# EAGLE design t6713 (EAGLE 8.5.0)
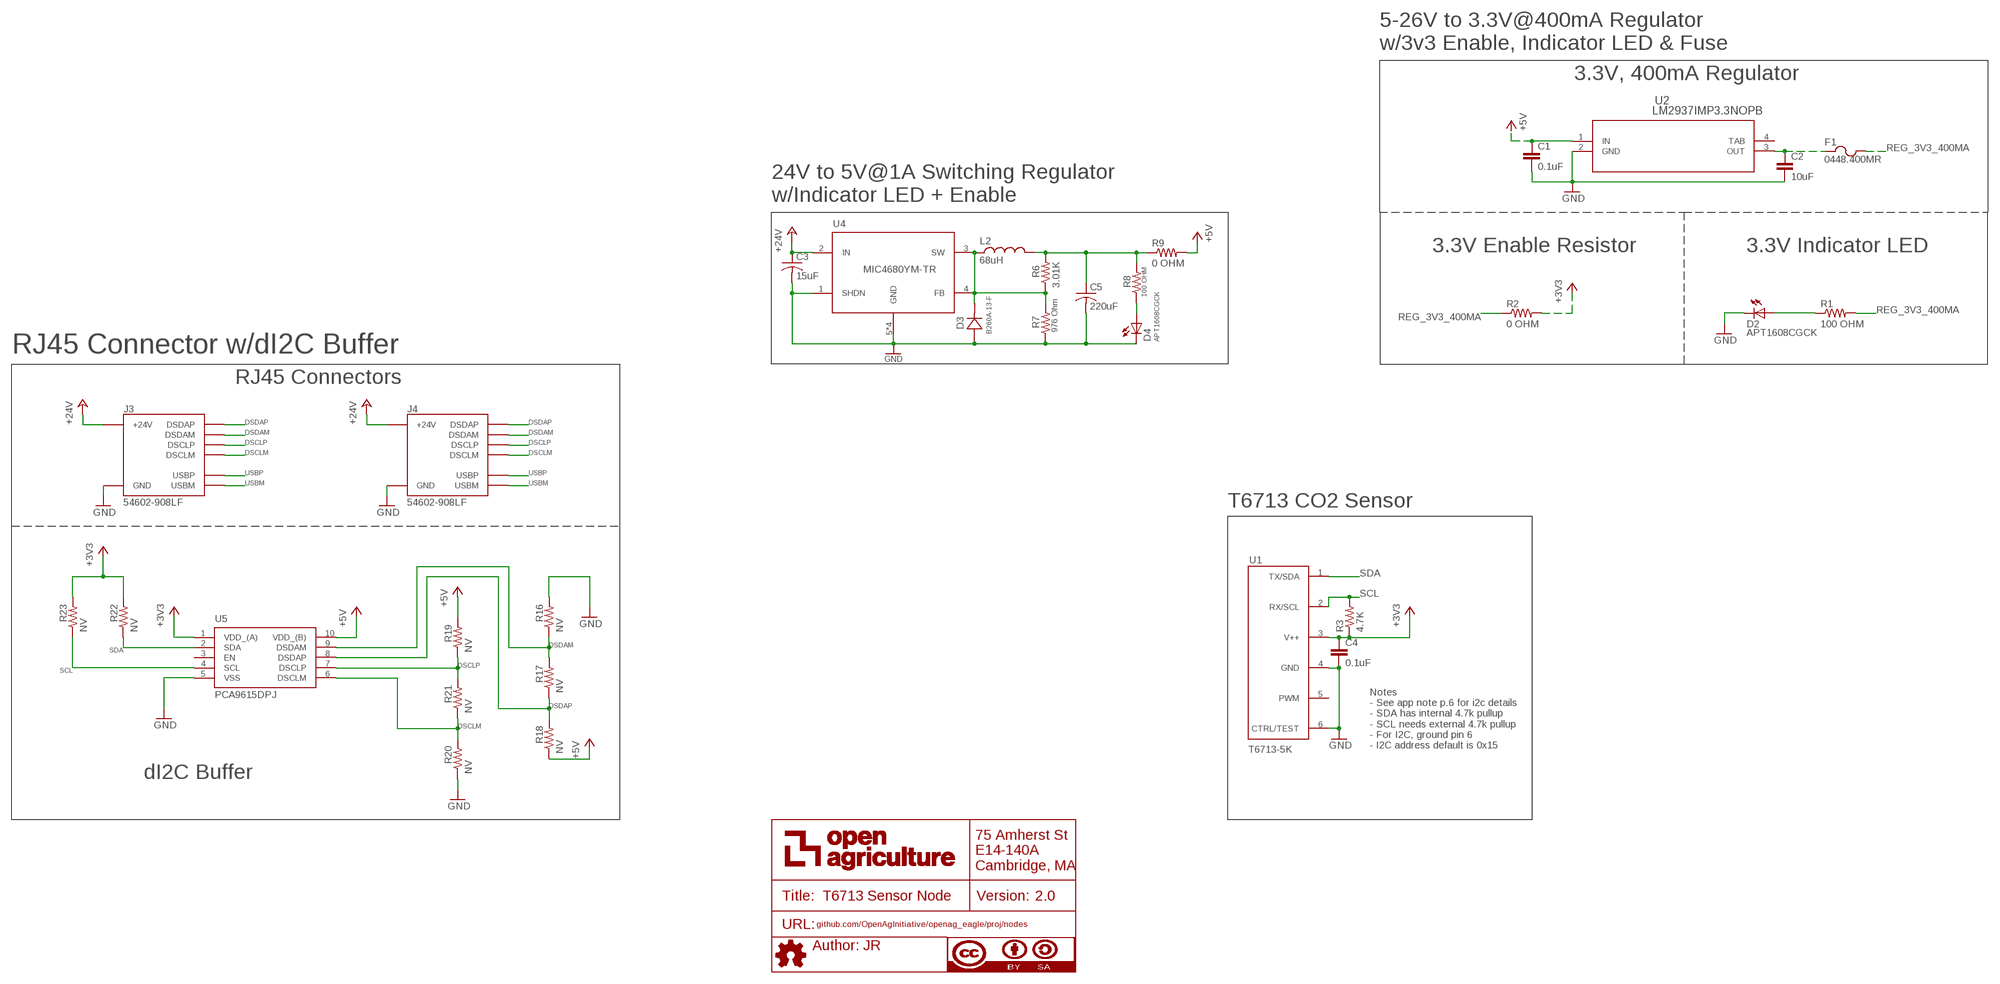
[diagram p0: schematic, sheet 1]

## Parts
C1  0.1uF  0.1UF-C0603C104K5RACTU  [C0603]
C2  10uF  10UF-GMK212BBJ106KG-T  [C0805]
C3  15uF  15UF-TPSD156K035R0100  [CT7343]
C4  0.1uF  0.1UF-C0603C104K5RACTU  [C0603]
C5  220uF  220UF-TPSY227K010R0100  [CT7343]
D2  APT1608CGCK  [CHIPLED_0603]
D3  B260A-13-F  [SMA]
D4  APT1608CGCK  [CHIPLED_0603]
F1  0448.400MR  0438.375WR  [0603]
FRAME1  DOCFIELD  [DOCFIELD]
J3  54602-908LF  OPENAG-V1-RJ45PTH  [OPENAG-V1-RJ45]
J4  54602-908LF  OPENAG-V1-RJ45PTH  [OPENAG-V1-RJ45]
L2  68uH  68UH-UP2B-680-R  [UP2B]
R1  100 OHM  100OHM-RC0603JR-07100RL  [RC0603N]
R2  0 OHM  0OHM-RC0603JR-070RL  [RC0603N]
R3  4.7K  4.7K-RC1206JR-074K7L  [R1206]
R6  3.01K  3.01K-RC0603FR-073K01L  [RC0603N]
R7  976 Ohm  982OHM-RC0603FR-07976RL  [RC0603N]
R8  100 OHM  100OHM-RC0603JR-07100RL  [RC0603N]
R9  0 OHM  0OHM-RC0603JR-070RL  [RC0603N]
R16  NV  R0603  [RC0603N]
R17  NV  R0603  [RC0603N]
R18  NV  R0603  [RC0603N]
R19  NV  R0603  [RC0603N]
R20  NV  R0603  [RC0603N]
R21  NV  R0603  [RC0603N]
R22  NV  R0603  [RC0603N]
R23  NV  R0603  [RC0603N]
U1  T6713-5K  [T6713]
U2  LM2937IMP3.3NOPB  LM2937IMP-3.3/NOPB  [MP04A]
U4  MIC4680YM-TR  [SOIC8]
U5  PCA9615DPJ  [SOP50P490X110-10N]

## Nets
+3V3: C4.1 R2.2 R3.1 R22.2 R23.2 U1.3(V++) U5.1(VDD_(A))
+5V: C1.1 R9.2 R18.1 R19.2 U2.1(IN) U5.10(VDD_(B))
+24V: C3.+(1(+)) J3.24V(6)(+24V) J4.24V(6)(+24V) U4.2(IN)
DSCLM: J3.DSCLM(5)(DSCLM) J4.DSCLM(5)(DSCLM) R20.2 R21.1 U5.6(DSCLM)
DSCLP: J3.DSCLP(4)(DSCLP) J4.DSCLP(4)(DSCLP) R19.1 R21.2 U5.7(DSCLP)
DSDAM: J3.DSDAM(2)(DSDAM) J4.DSDAM(2)(DSDAM) R16.1 R17.2 U5.9(DSDAM)
DSDAP: J3.DSDAP(1)(DSDAP) J4.DSDAP(1)(DSDAP) R17.1 R18.2 U5.8(DSDAP)
GND: C1.2 C2.2 C3.-(2(-)) C4.2 C5.-(2(-)) D2.C D3.2 D4.C J3.GND(3)(GND) J4.GND(3)(GND) R7.1 R16.2 R20.1 U1.4(GND) U1.6(CTRL/TEST) U2.2(GND) U4.1(SHDN) U4.5(GND) U4.6(GND) U4.7(GND) U4.8(GND) U5.5(VSS)
N$4: D3.1 L2.1 R6.1 R7.2 U4.3(SW) U4.4(FB)
N$6: D2.A R1.1
N$7: C2.1 F1.1 U2.3(OUT)
N$8: D4.A R8.1
N$9: C5.+(1(+)) L2.2 R6.2 R8.2 R9.1
REG_3V3_400MA: F1.2 R1.2 R2.1
SCL: R3.2 R23.1 U1.2(RX/SCL) U5.4(SCL)
SDA: R22.1 U1.1(TX/SDA) U5.2(SDA)
USBM: J3.USBM(8)(USBM) J4.USBM(8)(USBM)
USBP: J3.USBP(7)(USBP) J4.USBP(7)(USBP)
Unconnected: U1.5(PWM) U5.3(EN)

## Notes on the sheet
- 5-26V to 3.3V@400mA Regulator 
  w/3v3 Enable, Indicator LED & Fuse
- 3.3V, 400mA Regulator
- 24V to 5V@1A Switching Regulator
  w/Indicator LED + Enable
- 3.3V Enable Resistor | 3.3V Indicator LED
- RJ45 Connector w/dI2C Buffer
- RJ45 Connectors
- T6713 CO2 Sensor
- Notes
  - See app note p.6 for i2c details
  - SDA has internal 4.7k pullup
  - SCL needs external 4.7k pullup
  - For I2C, ground pin 6
  - I2C address default is 0x15
- dI2C Buffer

## Power pins joined to a net without a drawn wire
TAB: U2.4(TAB)

## Library data of the parts
C1 C4 = openag-capacitors:0.1UF-C0603C104K5RACTU: Kemet - C0603C104K5RACTU - CAP CER 0.1UF 50V X7R 0603 Description: 0.1µF ±10% 50V Ceramic Capacitor X7R 0603 (1608 Metric) Technical Specifications: Capacitance: 0.1µF Tolerance: ±10% Rated Voltage: 50V Temperature Coefficient: X7R Operating Temperature: -55°C ~ 125°C Package / Case: 0603 (1608 Metric) Datasheet(s): X7R Dielectric, 6.3-250 VDC <https://search.kemet.com/component-edge/download/datasheet/C0603C104K5RACTU.pdf> Vendor(s): Digikey: 399-5089-1-ND <https://www.digikey.com/product-detail/en/kemet/C0603C104K5RACTU/399-5089-1-ND/1465623>; POPULATE: YES; VERIFIED: NO
C2 = openag-capacitors:10UF-GMK212BBJ106KG-T: Taiyo Yuden - GMK212BBJ106KG-T - CAP CER 10UF 35V X5R 0805 Description: 10µF ±10% 35V Ceramic Capacitor X5R 0805 (2012 Metric) Technical Specifications: Capacitance: 10µF Tolerance: ±10% Rated Voltage: 35V Temperature Coefficient: X5R Operating Temperature: -55°C ~ 85°C Package / Case: 0805 (2012 Metric) Datasheet(s): GMK212BBJ106KG-T Spec <http://ds.yuden.co.jp/TYCOMPAS/ut/detail.do?productNo=GMK212BBJ106KG-T&fileName=GMK212BBJ106KG-T_SS&mode=specSheetDownload> Vendor(s): Digikey: 587-4893-1-ND <https://www.digikey.com/product-detail/en/taiyo-yuden/GMK212BBJ106KG-T/587-4893-1-ND/6563736>; POPULATE: YES; VERIFIED: NO
C3 = openag-capacitors:15UF-TPSD156K035R0100: AVX Corporation - TPSD156K035R0100 - CAP TANT 15UF 35V 10% 2917 Description: 15µF Molded Tantalum Capacitors 35V 2917 (7343 Metric) 100 mOhm Technical Specifications: Capacitance: 15µF Tolerance: ±10% Voltage - Rated: 35V Type: Molded ESR (Equivalent Series Resistance): 100 mOhm Operating Temperature: -55°C ~ 125°C Mounting Type: Surface Mount Package / Case: 2917 (7343 Metric) Size / Dimension: 0.287" L x 0.169" W (7.30mm x 4.30mm) Height - Seated (Max): 0.122" (3.10mm) Manufacturer Size Code: D Features: General Purpose Datasheet(s): TPS Series, Low ESR <http://datasheets.avx.com/TPS.pdf> Vendor(s): Digikey: 478-4100-1-ND <https://www.digikey.com/scripts/DkSearch/dksus.dll?Detail&itemSeq=250948407&uq=636531796868727362#>
C5 = openag-capacitors:220UF-TPSY227K010R0100: AVX Corporation - TPSY227K010R0100 - CAP TANT 220UF 10V 10% 2917 Description: 220µF Molded Tantalum Capacitors 10V 2917 (7343 Metric) 100 mOhm Technical Specifications: Capacitance: 220µF Tolerance: ±10% Voltage - Rated: 10V Type: Molded ESR (Equivalent Series Resistance): 100 mOhm Operating Temperature: -55°C ~ 125°C Mounting Type: Surface Mount Package / Case: 2917 (7343 Metric) Size / Dimension: 0.287" L x 0.169" W (7.30mm x 4.30mm) Height - Seated (Max): 0.079" (2.00mm) Manufacturer Size Code: Y Features: General Purpose Datasheet(s): TPS Series, Low ESR <http://datasheets.avx.com/TPS.pdf> Vendor(s): Digikey: 478-5408-1-ND <https://www.digikey.com/scripts/DkSearch/dksus.dll?Detail&itemSeq=250948888&uq=636531796868737363>
D2 D4 = openag-diodes:APT1608CGCK: Kingbright - APT1608CGCK - LED GREEN CLEAR 0603 SMD Description: Green 570nm LED Indication - Discrete 2.1V 0603 (1608 Metric) Technical Specifications: Color: Green Lens Color: Colorless Lens Transparency: Clear Millicandela Rating: 50mcd Lens Style/Size: Rectangle with Flat Top, 1.20mm x 0.80mm Voltage - Forward (Vf) (Typ): 2.1V Current - Test: 20mA Viewing Angle: 120° Mounting Type: Surface Mount Wavelength - Dominant: 570nm Wavelength - Peak: 574nm Package / Case: 0603 (1608 Metric) Supplier Device Package: Chip LED Size / Dimension: 1.60mm L x 0.80mm W Height (Max): 0.75mm Datasheet(s): APT1608CGCK <http://www.kingbrightusa.com/images/catalog/SPEC/APT1608CGCK.pdf> Vendor(s): Digikey: 754-1116-1-ND <https://www.digikey.com/product-detail/en/kingbright/APT1608CGCK/754-1116-1-ND/1747833#>; POPULATE: YES; VERIFIED: NO
D3 = openag-diodes:B260A-13-F: Diodes Incorporated - B260A-13-F - DIODE SCHOTTKY 60V 2A SMA Description: Diode Schottky 60V 2A Surface Mount SMA Technical Specifications: Diode Type: Schottky Voltage - DC Reverse (Vr) (Max): 60V Current - Average Rectified (Io): 2A Voltage - Forward (Vf) (Max) @ If: 700mV @ 2A Speed: Fast Recovery =< 500ns, > 200mA (Io) Current - Reverse Leakage @ Vr: 500µA @ 60V Capacitance @ Vr, F: 200pF @ 4V, 1MHz Mounting Type: Surface Mount Package / Case: DO-214AC, SMA Supplier Device Package: SMA Operating Temperature - Junction: -65°C ~ 150°C Base Part Number: B260 Datasheet(s): B220(A) - B260(A) <https://www.diodes.com/assets/Datasheets/ds13004.pdf> Vendor(s): Digikey: B260A-FDICT-ND <https://www.digikey.com/product-detail/en/B260A-13-F/B260A-FDICT-ND/755494>
F1 = openag-fuses:0438.375WR: Littelfuse Inc. - 0448.400MR - FUSE BOARD MNT 400MA 125VAC/VDC Description: FUSE BOARD MNT 400MA 125VAC/VDC Technical Specifications: Fuse Type: Board Mount (Cartridge Style Excluded) Current Rating: 400mA Voltage Rating - AC: 125V Voltage Rating - DC: 125V Response Time: Fast Package / Case: 2-SMD, Square End Block Mounting Type: Surface Mount Breaking Capacity @ Rated Voltage: 50A Melting I²t: 0.0416 Approvals: CSA, UL Operating Temperature: -55°C ~ 125°C Size / Dimension: 0.240" L x 0.106" W x 0.106" H (6.10mm x 2.69mm x 2.69mm) DC Cold Resistance: 0.4895 Ohms Datasheet(s): 448 Series Datasheet <http://www.littelfuse.com/~/media/electronics/datasheets/fuses/littelfuse_fuse_448_datasheet.pdf.pdf> Vendor(s): Digikey: F5573CT-ND <https://www.digikey.com/product-detail/en/littelfuse-inc/0448.400MR/F5573CT-ND/3306934>; POPULATE: YES; VERIFIED: YES
FRAME1 = openag-frames:DOCFIELD: DOCUMENT FIELD; AUTHOR: JR; TITLE: T6713 Sensor Node; URL: github.com/OpenAgInitiative/openag_eagle/proj/nodes; VER: 2.0
J3 J4 = openag_connector:OPENAG-V1-RJ45: Amphenol FCI - 54602-908LF - CONN MOD JACK 8P8C R/A UNSHLD Description: Jack Modular Connector 8p8c (RJ45, Ethernet) 90� Angle (Right) Unshielded Cat3 Technical Specifications: Connector Type: Jack Number of Positions/Contacts: 8p8c (RJ45, Ethernet) Number of Ports: 1 Number of Rows: 1 Mounting Type: Through Hole Orientation: 90� Angle (Right) Termination: Solder Shielding: Unshielded Ratings: Cat3 Features: Board Lock LED Color: Does Not Contain LED Tab Direction: Down Contact Material: Copper Alloy Contact Finish: Gold Contact Finish Thickness: 15�in (0.38�m) Housing Material: Polyester, Glass Filled Operating Temperature: -40�C ~ 70�C Datasheet(s): 54601-x04(zzz)WPLF Drawing <http://cdn.amphenol-icc.com/media/wysiwyg/files/drawing/c-bmj-0102.pdf> Vendor(s): Digikey: 609-1046-ND <https://www.digikey.com/product-detail/en/amphenol-fci/54602-908LF/609-1046-ND/1001360>; POPULATE: YES; VERIFIED: NO
L2 = openag-inductors:68UH-UP2B-680-R: Eaton - UP2B-680-R - FIXED IND 68UH 1.5A 178.7 MOHM Description: 68µH Unshielded Wirewound Inductor 1.5A 178.7 mOhm Max Nonstandard Technical Specifications: Type: Wirewound Material - Core: Ferrite Inductance: 68µH Tolerance: ±20% Current Rating: 1.5A Current - Saturation: 1.2A Shielding: Unshielded DC Resistance (DCR): 178.7 mOhm Max Operating Temperature: -40°C ~ 85°C Frequency - Test: 100kHz Mounting Type: Surface Mount Package / Case: Nonstandard Size / Dimension: 0.550" L x 0.410" W (13.97mm x 10.41mm) Height - Seated (Max): 0.236" (6.00mm) Datasheet(s): UNI-PAC (-R) <http://www.cooperindustries.com/content/dam/public/bussmann/Electronics/Resources/product-datasheets/BUS_Elx_PM_4308_UNI_PAC_Power_Inductors.pdf> Vendor(s): Digikey: 513-1083-1-ND <https://www.digikey.com/scripts/DkSearch/dksus.dll?Detail&itemSeq=250945518&uq=636531821133403587>
R1 R8 = openag-resistors:100OHM-RC0603JR-07100RL: Yageo - RC0603JR-07100RL - RES SMD 100 OHM 5% 1/10W 0603 Description: 100 Ohms ±5% 0.1W, 1/10W Chip Resistor 0603 (1608 Metric) Moisture Resistant Thick Film Technical Specifications: Resistance: 100 Ohms Tolerance: ±5% Power (Watts): 0.1W, 1/10W Composition: Thick Film Features: Moisture Resistant Temperature Coefficient: ±100ppm/°C Operating Temperature: -55°C ~ 155°C Package / Case: 0603 (1608 Metric) Supplier Device Package: 0603 Size / Dimension: 0.063" L x 0.032" W (1.60mm x 0.80mm) Height - Seated (Max): 0.022" (0.55mm) Number of Terminations: 2 Datasheet(s): Thick Film Chip Resistor Intro <http://www.yageo.com.tw/exep/pages/download/literatures/PYu-R_INT-thick_7.pdf> Chip Resistor Marking <http://www.yageo.com/exep/pages/download/literatures/PYu-R_Marking_2.pdf> RC Series, L Datasheet <http://www.yageo.com/documents/recent/PYu-RC_Group_51_RoHS_L_8.pdf> Vendor(s): Digikey: 311-100GRCT-ND <https://www.digikey.com/product-detail/en/yageo/RC0603JR-07100RL/311-100GRCT-ND/729644>; POPULATE: YES; VERIFIED: NO
R2 R9 = openag-resistors:0OHM-RC0603JR-070RL: Yageo - RC0603JR-070RL - RES SMD 0 OHM JUMPER 1/10W 0603 Description: 0 Ohms Jumper 0.1W, 1/10W Chip Resistor 0603 (1608 Metric) Moisture Resistant Thick Film Technical Specifications: Resistance: 0 Ohms Power: 0.1W, 1/10W Operating Temperature: -55°C ~ 155°C Package / Case: 0603 (1608 Metric) Datasheet(s): RC Series, L Datasheet <http://www.yageo.com/documents/recent/PYu-RC_Group_51_RoHS_L_8.pdf> Vendor(s): Digikey: 311-0.0GRCT-ND <https://www.digikey.com/product-detail/en/yageo/RC0603JR-070RL/311-0.0GRCT-ND/729622>; POPULATE: YES; VERIFIED: NO
R3 = openag-resistors:4.7K-RC1206JR-074K7L: Yageo - RC1206JR-074K7L - RES SMD 4.7K OHM 5% 1/4W 1206 Description: 4.7 kOhms ±5% 0.25W, 1/4W Chip Resistor 1206 (3216 Metric) Moisture Resistant Thick Film Technical Specifications: Resistance: 4.7 kOhms Tolerance: ±5% Power (Watts): 0.25W, 1/4W Composition: Thick Film Features: Moisture Resistant Temperature Coefficient: ±100ppm/°C Operating Temperature: -55°C ~ 155°C Package / Case: 1206 (3216 Metric) Supplier Device Package: 1206 Size / Dimension: 0.122" L x 0.063" W (3.10mm x 1.60mm) Height - Seated (Max): 0.026" (0.65mm) Number of Terminations: 2 Datasheet(s): Thick Film Chip Resistor Intro <http://www.yageo.com.tw/exep/pages/download/literatures/PYu-R_INT-thick_7.pdf> Chip Resistor Marking <http://www.yageo.com/exep/pages/download/literatures/PYu-R_Marking_2.pdf> RC Series, L Datasheet <http://www.yageo.com/documents/recent/PYu-RC_Group_51_RoHS_L_8.pdf> Vendor(s): Digikey: 311-4.7KERCT-ND <https://www.digikey.com/product-detail/en/yageo/RC1206JR-074K7L/311-4.7KERCT-ND/732242>; POPULATE: YES; VERIFIED: NO
R6 = openag-resistors:3.01K-RC0603FR-073K01L: Yageo - RC0603FR-073K01L - RES SMD 3.01K OHM 1% 1/10W 0603 Description: 3.01 kOhms ±1% 0.1W, 1/10W Chip Resistor 0603 (1608 Metric) Moisture Resistant Thick Film Technical Specifications: Resistance: 3.01 kOhms Tolerance: ±1% Power (Watts): 0.1W, 1/10W Composition: Thick Film Features: Moisture Resistant Temperature Coefficient: ±100ppm/°C Operating Temperature: -55°C ~ 155°C Package / Case: 0603 (1608 Metric) Supplier Device Package: 0603 Size / Dimension: 0.063" L x 0.032" W (1.60mm x 0.80mm) Height - Seated (Max): 0.022" (0.55mm) Number of Terminations: 2 Datasheet(s): Chip Resistor Marking <http://www.yageo.com/exep/pages/download/literatures/PYu-R_Marking_2.pdf> RC Series, L Datasheet <http://www.yageo.com/documents/recent/PYu-RC_Group_51_RoHS_L_8.pdf> Vendor(s): Digikey: 311-3.01KHRCT-ND <https://www.digikey.com/scripts/DkSearch/dksus.dll?Detail&itemSeq=250949714&uq=636531832410541188>
R7 = openag-resistors:982OHM-RC0603FR-07976RL: Yageo - RC0603FR-07976RL - RES SMD 976 OHM 1% 1/10W 0603 Description: 976 Ohms ±1% 0.1W, 1/10W Chip Resistor 0603 (1608 Metric) Moisture Resistant Thick Film Technical Specifications: Resistance: 976 Ohms Tolerance: ±1% Power (Watts): 0.1W, 1/10W Composition: Thick Film Features: Moisture Resistant Temperature Coefficient: ±100ppm/°C Operating Temperature: -55°C ~ 155°C Package / Case: 0603 (1608 Metric) Supplier Device Package: 0603 Size / Dimension: 0.063" L x 0.032" W (1.60mm x 0.80mm) Height - Seated (Max): 0.022" (0.55mm) Number of Terminations: 2 Datasheet(s): Chip Resistor Marking <http://www.yageo.com/exep/pages/download/literatures/PYu-R_Marking_2.pdf> RC Series, L Datasheet <http://www.yageo.com/documents/recent/PYu-RC_Group_51_RoHS_L_8.pdf> Vendor(s): Digikey: 311-976HRCT-ND <https://www.digikey.com/scripts/DkSearch/dksus.dll?Detail&itemSeq=250949870&uq=636531835229553061>
R16-R23 = openag-resistors:R0603: Placeholder 0603 Resistor
U1 = openag-sensors:T6713-5K: Amphenol Advanced Sensors - T6713-5K - CO2 MODULE 5000PPM DIFFUSION Description: CO2 Sensor I²C Technical Specifications: Type: CO2 Accuracy: ±2% Output: I²C Operating Temperature: 14 ~ 140°F (-10 ~ 60°C) Voltage - Supply: 4.5 V ~ 5.5 V Current - Supply: 200mA Datasheet(s): T6713 Series Datasheet <http://www.amphenol-sensors.com/en/component/edocman/297-telaire-t6713-series-datasheet/download?Itemid=591> Telaire CO2 Module Selection Guide <http://www.amphenol-sensors.com/en/component/edocman/488-telaire-co2-module-selection-guide-single-or-dual-channel/download?Itemid=591> T67xx Appl Note <http://www.amphenol-sensors.com/en/component/edocman/332-telaire-6700-series-application-note/download?Itemid=591> Vendor(s): Digikey: 235-1374-ND <https://www.digikey.com/products/en?keywords=235-1374>; POPULATE: YES; VERIFIED: NO
U2 = openag-regulators:LM2937IMP-3.3/NOPB: Texas Instruments - LM2937IMP-3.3/NOPB - IC REG LIN 3.3V 400MA SOT223-4 Description: Linear Voltage Regulator IC Positive Fixed 1 Output 3.3V 400mA SOT-223-4 Technical Specifications: Output Configuration: Positive Output Type: Fixed Number of Regulators: 1 Voltage - Input (Max): 26V Voltage - Output (Min/Fixed): 3.3V Voltage Dropout (Max): 1V @ 50mA Current - Output: 400mA Current - Quiescent (Iq): 2mA Current - Supply (Max): 1.25A Protection Features: Over Temperature, Reverse Polarity, Short Circuit Operating Temperature: -40°C ~ 85°C Mounting Type: Surface Mount Package / Case: TO-261-4, TO-261AA Supplier Device Package: SOT-223-4 Base Part Number: LM2937 Datasheet(s): LM2937-2.5, LM2937-3.3 Datasheet <http://www.ti.com/lit/ds/symlink/lm2937-2.5.pdf> Vendor(s): Digikey: LM2937IMP-3.3/NOPBCT-ND <https://www.digikey.com/product-detail/en/texas-instruments/LM2937IMP-3.3-NOPB/LM2937IMP-3.3-NOPBCT-ND/270742#>; POPULATE: YES; VERIFIED: NO
U4 = openag-regulators:MIC4680YM-TR: Microchip Technology - MIC4680YM-TR - IC REG BUCK BOOST ADJ 1.3A 8SOIC Description: Buck, Buck-Boost Switching Regulator IC Positive Adjustable 1.23V 1 Output 1.3A 8-SOIC (0.154", 3.90mm Width) Technical Specifications: Function: Step-Down, Step-Up/Step-Down Output Configuration: Positive Topology: Buck, Buck-Boost Output Type: Adjustable Number of Outputs: 1 Voltage - Input (Min): 4V Voltage - Input (Max): 34V Voltage - Output (Min/Fixed): 1.23V Voltage - Output (Max): 32.98V Current - Output: 1.3A Frequency - Switching: 200kHz Synchronous Rectifier: No Operating Temperature: -40°C ~ 125°C (TJ) Mounting Type: Surface Mount Package / Case: 8-SOIC (0.154", 3.90mm Width) Supplier Device Package: 8-SOIC Base Part Number: MIC4680 Datasheet(s): MIC4680 <http://www.microchip.com/mymicrochip/filehandler.aspx?ddocname=en579250> Vendor(s): Digikey: 576-1222-1-ND <https://www.digikey.com/scripts/DkSearch/dksus.dll?Detail&itemSeq=250950999&uq=636531791983475304>
U5 = openag-buffers:PCA9615DPJ: NXP USA Inc. - PCA9615DPJ - IC REDRIVER I2C 2CH 10TSSOP Description: Buffer, ReDriver 2 Channel 400kHz 10-TSSOP Technical Specifications: Type: Buffer, ReDriver Applications: I²C Input: 2-Wire Bus Output: 2-Wire Bus Data Rate (Max): 400kHz Number of Channels: 2 Capacitance - Input: 7pF Voltage - Supply: 2.3 V ~ 5.5 V Current - Supply: 16µA Operating Temperature: -40°C ~ 85°C Package / Case: 10-TFSOP, 10-MSOP (0.118", 3.00mm Width) Supplier Device Package: 10-TSSOP Base Part Number: PCA9615 Datasheet(s): PCA9615DP <http://www.nxp.com/documents/data_sheet/PCA9615.pdf> Vendor(s): Digikey: 568-11484-1-ND <https://www.digikey.com/product-detail/en/nxp-usa-inc/PCA9615DPJ/568-11484-1-ND/4864508>

## Board
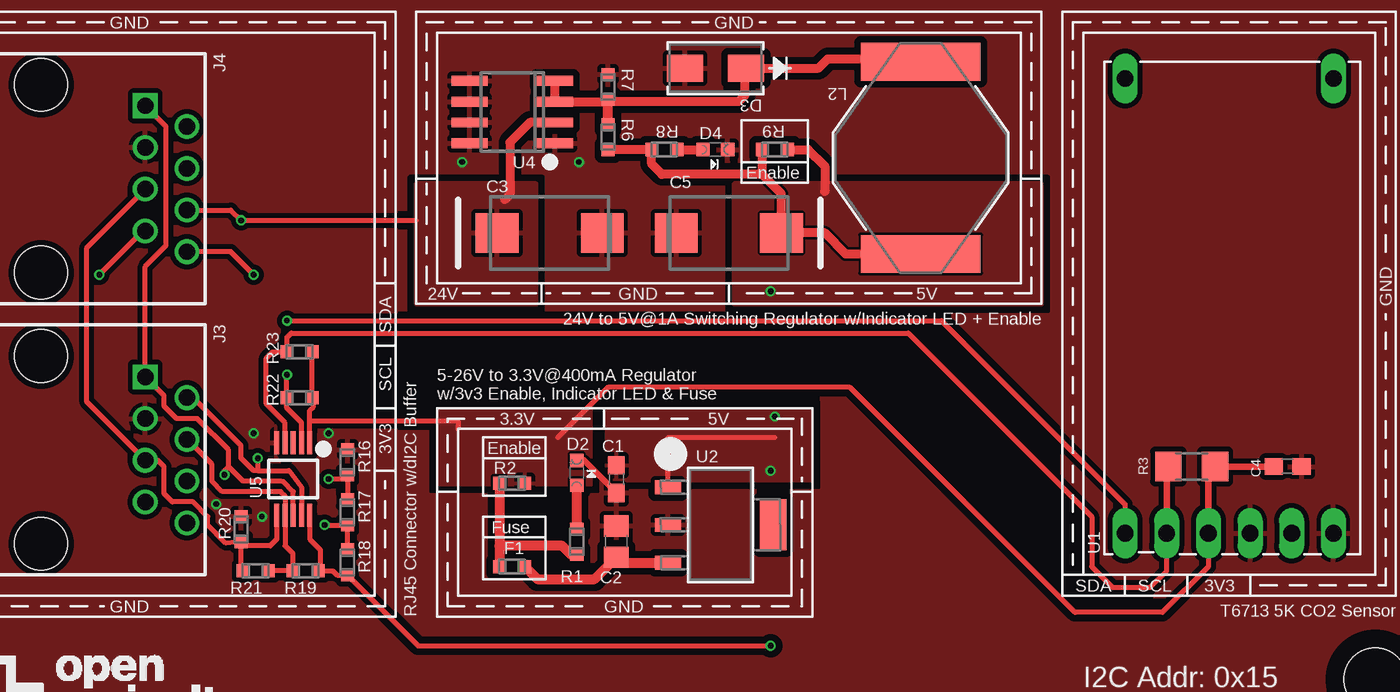
[diagram p1: board, top side]
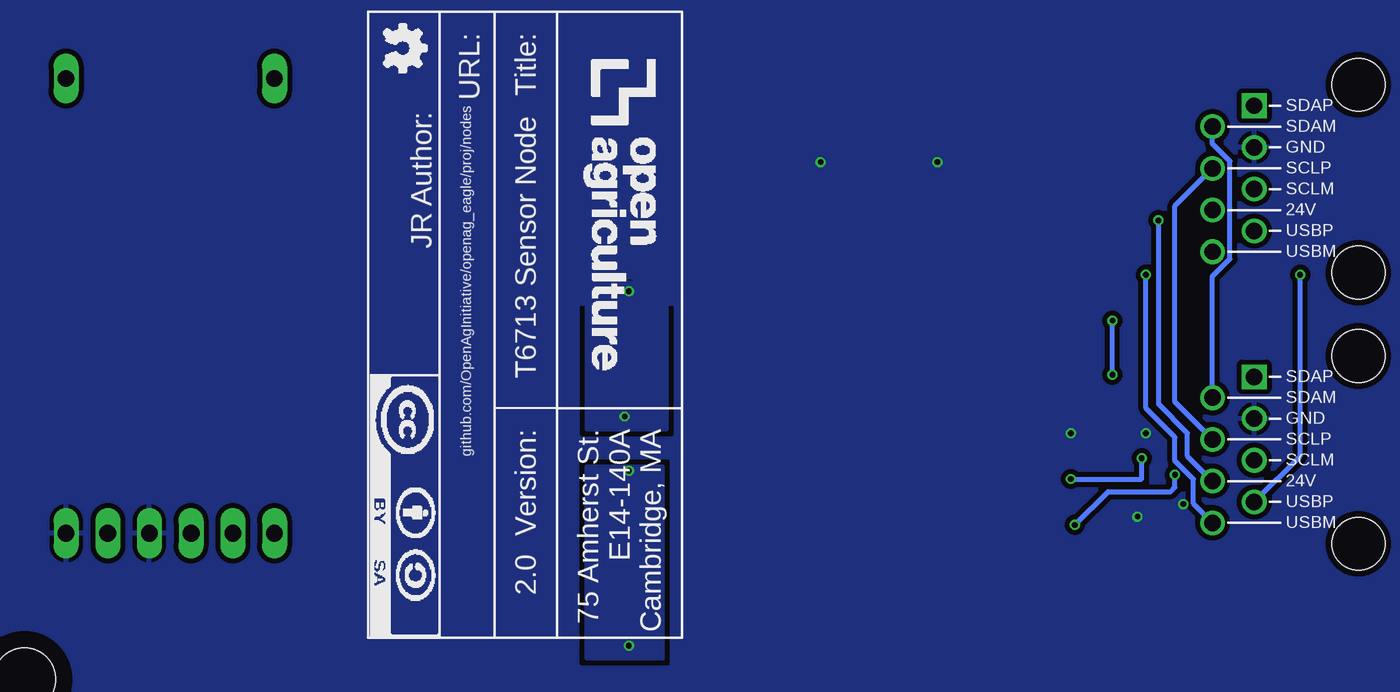
[diagram p2: board, bottom side, seen from below]

No outline drawn. Coordinates in mm, seen from the top.
Copper layers (1*16): Top 0.035559375mm / dielectric 1.6mm / Bottom 0.035559375mm
Design rules "oshpark-2layer": minimum track width 6mil, minimum drill 10mil, track to track 6mil, track to pad 6mil, pad to pad 6mil, via to via 6mil, smd to smd 6mil, copper to edge 15mil, drill to drill 6mil, minimum pad ring 5mil, minimum via ring 5mil, stop-mask expansion 2.5mil, vias tented up to drill 0mil, thermal gap 10mil

### Footprints (pad centres in the part's own frame; a part is rotated, then mirrored left to right if it is on the bottom)
C0603 = smd 1.1 x 1: 1 -0.85,0; 2 0.85,0
C0805 = smd 1.3 x 1.5: 1 -0.95,0; 2 0.95,0
CT7343 = smd 2.6 x 2.4: + -3.2,0; - 3.2,0
CHIPLED_0603 = smd 0.8 x 0.8: A 0,-0.75; C 0,0.75
SMA = smd 2.18 x 1.63: 1 -1.857,0; 2 1.857,0
0603 = smd 0.756 x 0.8: 1 -0.778,0; 2 0.778,0
OPENAG-V1-RJ45 = drill 1: 24V(6) 1.905,8.89; DSCLM(5) 0.635,6.35; DSCLP(4) -0.635,8.89; DSDAM(2) -3.175,8.89; GND(3) -1.905,6.35; USBM(8) 4.445,8.89; USBP(7) 3.175,6.35 | drill 1 square: DSDAP(1) -4.445,6.35 | hole 3.2: -5.715,0; 5.715,0
UP2B = smd 2.311 x 7.29: 1 -5.855,0; 2 5.855,0
RC0603N = smd 0.756 x 0.8: 1 -0.778,0; 2 0.778,0
R1206 = smd 1.6 x 1.803: 1 -1.422,0; 2 1.422,0
T6713 = drill 1.016 long: 1 1.27,-1.27; 2 1.27,-3.81; 3 1.27,-6.35; 4 1.27,-8.89; 5 1.27,-11.43; 6 1.27,-13.97; 7 28.96,-13.97; 8 28.96,-1.27
MP04A = smd 1.6 x 0.838: 1 -3.2,2.3; 2 -3.2,0; 3 -3.2,-2.3 | smd 1.6 x 3.099: 4 3.2,0
SOIC8 = smd 0.6 x 2.2: 1 -1.905,-2.6; 2 -0.635,-2.6; 3 0.635,-2.6; 4 1.905,-2.6; 5 1.905,2.6; 6 0.635,2.6; 7 -0.635,2.6; 8 -1.905,2.6
SOP50P490X110-10N = smd 1.4 x 0.3: 1 -2.2,1; 2 -2.2,0.5; 3 -2.2,0; 4 -2.2,-0.5; 5 -2.2,-1; 6 2.2,-1; 7 2.2,-0.5; 8 2.2,0; 9 2.2,0.5; 10 2.2,1
OPENAG-CORNER-MOUNTING-HOLE = hole 3.81: 0,0

### Placement (x,y rotation side)
C1  47.75,16 270 top
C2  47.75,12.19 90 top
C3  43.69,30.99 0 top
C4  88.65,16.76 0 top
C5  54.61,30.99 180 top
D2  45.34,16.38 0 top
D3  53.78,41.02 180 top
D4  53.78,36.07 270 top
F1  41.4,10.67 180 top
FRAME1  73.03,44.45 270 bottom
J3  12.7,17.78 270 top
J4  12.7,34.29 270 top
L2  66.29,35.56 270 top
R1  45.34,12.19 270 top
R2  41.4,15.75 0 top
R3  82.8,16.76 180 top
R6  47.24,36.83 270 top
R7  47.24,39.88 270 top
R8  50.67,36.07 180 top
R9  57.4,36.07 0 top
R16  31.37,17.02 90 top
R17  31.37,13.97 90 top
R18  31.37,10.92 90 top
R19  28.83,10.41 0 top
R20  24.89,12.95 270 top
R21  25.78,10.41 0 top
R22  28.45,20.95 0 top
R23  28.45,23.75 0 top
U1  77.47,11.43 90 top
U2  54.1,13.21 0 top
U4  41.4,38.35 90 top
U5  28.07,16 270 top
U$1  [OPENAG-CORNER-MOUNTING-HOLE]  3.81,3.81 0 top
U$2  [OPENAG-CORNER-MOUNTING-HOLE]  93.98,3.81 90 top
U$3  [OPENAG-CORNER-MOUNTING-HOLE]  3.81,48.26 270 top
U$4  [OPENAG-CORNER-MOUNTING-HOLE]  93.98,48.26 180 top
U$5  [OPENAG-LOGO-750-MIL]  8.89,1.27 0 top

### Tracks (layer width: path | path; a pad name or v marks a point on that pad's centre or on a via)
+3V3
  Top 0.305: U5.1 29.07,19.56 | 29.07,19.56 29.07,20.18 29.3,20.41 29.3,20.88 R22.2 R23.2 | 38.1,19.05 38.1,19.56 29.07,19.56 | U1.3 83.82,10.67 81.03,7.87 75.69,7.87 61.98,21.59 47.24,21.59 44.2,18.54
  Top 0.406: 83.82,16.76 R3.1 | R3.1 C4.1 | U1.3 83.82,16.36 R3.1
  pour Top: 46.23,20.32 46.23,15.62 36.83,15.62 36.83,20.32
+5V  (via drill 0.35)
  Top 0.305: U5.10 29.07,12.34 29.72,11.68 29.72,10.45 R19.2 30.48,10.41 30.75,10.14 R18.1 35.67,5.84 v57.15,5.84 | U2.1 50.9,18.54 57.4,18.54
  Top 0.559: R9.2 59.44,36.07 60.45,35.05 60.45,33.53
  other vias: 57.4,19.81 57.15,27.43 57.15,16.51
  pour Top: 73.66,26.67 73.66,33.97 54.93,33.97 54.93,26.67
  pour Top: 47.12,20.32 47.12,15.88 59.69,15.88 59.69,20.32
  pour Bottom (isolate 0.305): 59.69,19.05 54.86,19.05 54.86,27.94 59.69,27.94
  pour Bottom (isolate 0.305): 59.69,16.76 55.12,16.76 55.12,5.08 59.69,5.08
+24V  (via drill 0.35)
  Top 0.305: J4.24V(6) 24.26,32.38 v24.89,31.75 35.56,31.75
  Top 0.559: U4.2 42.48,37.72 41.27,36.51 41.27,33.34 40.96,33.02
  Bottom 0.305: J3.24V(6) 23.11,17.4 23.11,18.8 24.89,20.57 v24.89,31.75
  pour Top: 35.56,26.67 42.86,26.67 42.86,33.97 35.56,33.97
DSCLM
  Top 0.305: R21.1 24.89,10.45 24.89,11.94 | 24.89,11.94 R20.2 23.96,12.1 22.86,13.21 22.86,13.72 21.97,14.61 20.7,14.61 20.19,15.11 20.19,16.76 19.81,17.14 J3.DSCLM(5) 15.49,20.7 15.49,30.1 J4.DSCLM(5) | U5.6 27.07,12.34 26.67,11.94 24.89,11.94
DSCLP
  Top 0.305: R21.2 R19.1 28.05,11.45 27.57,11.94 U5.7 27.57,14.98 27.3,15.24 23.75,15.24 23.11,15.88 23.11,16.89 J3.DSCLP(4)
  Bottom 0.305: J3.DSCLP(4) 23.88,20.7 23.88,32.64 J4.DSCLP(4)
DSDAM  (via drill 0.35)
  Top 0.305: J3.DSDAM(2) 21.97,20.95 24.89,18.03 24.89,17.27 25.65,16.51 25.91,16.51 | 25.91,16.51 27.81,16.51 28.57,15.49 U5.9 | R17.2 R16.1 arc-90 31.2,16 v30.23,16 30.1,16 | v25.91,17.27 25.91,16.51
  Bottom 0.305: v30.23,16 25.91,16 v25.91,17.27 | J3.DSDAM(2) 21.59,28.35 20.54,29.41 20.54,35.36 21.59,36.42 J4.DSDAM(2)
DSDAP  (via drill 0.35)
  Top 0.305: R18.2 R17.1 29.99,13.19 v29.97,13.21 | 24.13,16.76 25.02,15.88 27.3,15.88 27.48,15.82 28.07,15.24 U5.8 | v23.88,16.26 23.88,16.51 24.13,16.76 | 24.13,16.76 24.13,17.78 22.23,19.68 20.95,19.68 20.19,20.45 20.19,21.08 J3.DSDAP(1) 19.05,28.96 20.32,30.23 20.32,37.47 J4.DSDAP(1)
  Bottom 0.305: v29.97,13.21 27.94,15.24 24.13,15.24 23.88,15.49 v23.88,16.26
GND  (via drill 0.35)
  Top 0.406: D2.C 45.77,17.13 C1.2
  other vias: 45.47,35.31 38.35,35.31 25.65,18.8 30.23,18.8 26.16,13.72 23.37,14.48
  pour Top (isolate 0.406, rank 3): 0,52.07 97.79,52.07 97.79,0 0,0
  pour Bottom (isolate 0.305, rank 3): 97.79,52.07 97.79,0 0,0 0,52.07
  pour Top (isolate 0.406, rank 2): 73.66,44.45 35.56,44.45 35.56,26.67 73.66,26.67
  pour Bottom (isolate 0.406): 73.66,44.45 35.56,44.45 35.56,26.67 73.66,26.67
  pour Top (isolate 0.305): 95.25,8.89 95.25,44.45 74.93,44.45 74.93,8.89
  pour Top (isolate 0.406, rank 3): 36.83,20.32 36.83,7.62 59.69,7.62 59.69,20.32
  pour Top (isolate 0.305): 0,7.62 34.29,7.62 34.29,44.45 0,44.45
  pour Bottom (isolate 0.305): 34.29,7.62 34.29,44.45 0,44.45 0,7.62
N$4
  Top 0.559: 47.13,38.99 U4.3 U4.4 | 47.13,38.99 R7.2 | L2.1 66.12,41.59 60.64,41.59 60.07,41.02 D3.1 55.56,40.94 55.56,39.37 55.18,38.99 47.13,38.99
  Top 0.61: R6.1 R7.2
N$6
  Top 0.61: D2.A R1.1
N$7
  Top 0.61: 47.93,10.91 C2.1 | C2.1 48.09,10.91 U2.3 | F1.1 42.94,9.91 46.42,9.91 C2.1
N$8
  Top 0.559: R8.1 D4.A
N$9
  Top 0.559: L2.2 61.73,29.7 60.45,30.99 C5.+ 57.81,33.38 56.63,34.56 | 56.63,34.56 50.53,34.56 49.9,35.2 R8.2 49.88,36.05 R6.2 | R9.1 56.63,34.56
REG_3V3_400MA
  Top 0.61: R2.1 40.62,11.94 | 40.62,11.94 F1.2 | R1.2 44.97,11.41 44.45,11.94 40.62,11.94
SCL
  Top 0.305: U5.4 27.57,19.42 26.42,20.57 26.42,23.37 26.8,23.75 R23.1 27.69,23.77 27.69,24.64 27.94,24.89 65.53,24.89 76.71,13.72 76.71,10.67 77.98,9.4 80.26,9.4 81.28,10.41 U1.2
  Top 0.406: U1.2 81.28,16.76 R3.2
SDA  (via drill 0.35)
  Top 0.305: U5.2 28.57,19.44 27.67,20.34 R22.1 27.67,22.34 v27.69,22.35 | v27.69,25.65 67.56,25.65 78.74,14.48 U1.1
  Bottom 0.305: v27.69,22.35 v27.69,25.65
USBM  (via drill 0.35)
  Top 0.305: v25.65,28.45 24.26,29.84 J4.USBM(8)
  Bottom 0.305: J3.USBM(8) 22.76,14.51 22.76,16 23.88,17.11 23.88,18.54 25.65,20.32 v25.65,28.45
USBP  (via drill 0.35)
  Top 0.305: v16.26,28.45 18.92,31.11 J4.USBP(7)
  Bottom 0.305: J3.USBP(7) 16.26,17.4 v16.26,28.45

### Text on the board
tPlace: T6713 CO2 Sensor Node | GND | GND | Enable | GND | 24V | GND | 5V | 24V to 5V@1A Switching Regulator w/Indicator LED + Enable | SDA | SCL | 5-26V to 3.3V@400mA Regulator / w/3v3 Enable, Indicator LED & Fuse | 3.3V | 5V | 3V3 | Enable | EDGE | Fuse | GND | SDA | SCL | 3V3 | RJ45 Connector w/dI2C Buffer | GND | T6713 5K CO2 Sensor | I2C Addr: 0x15